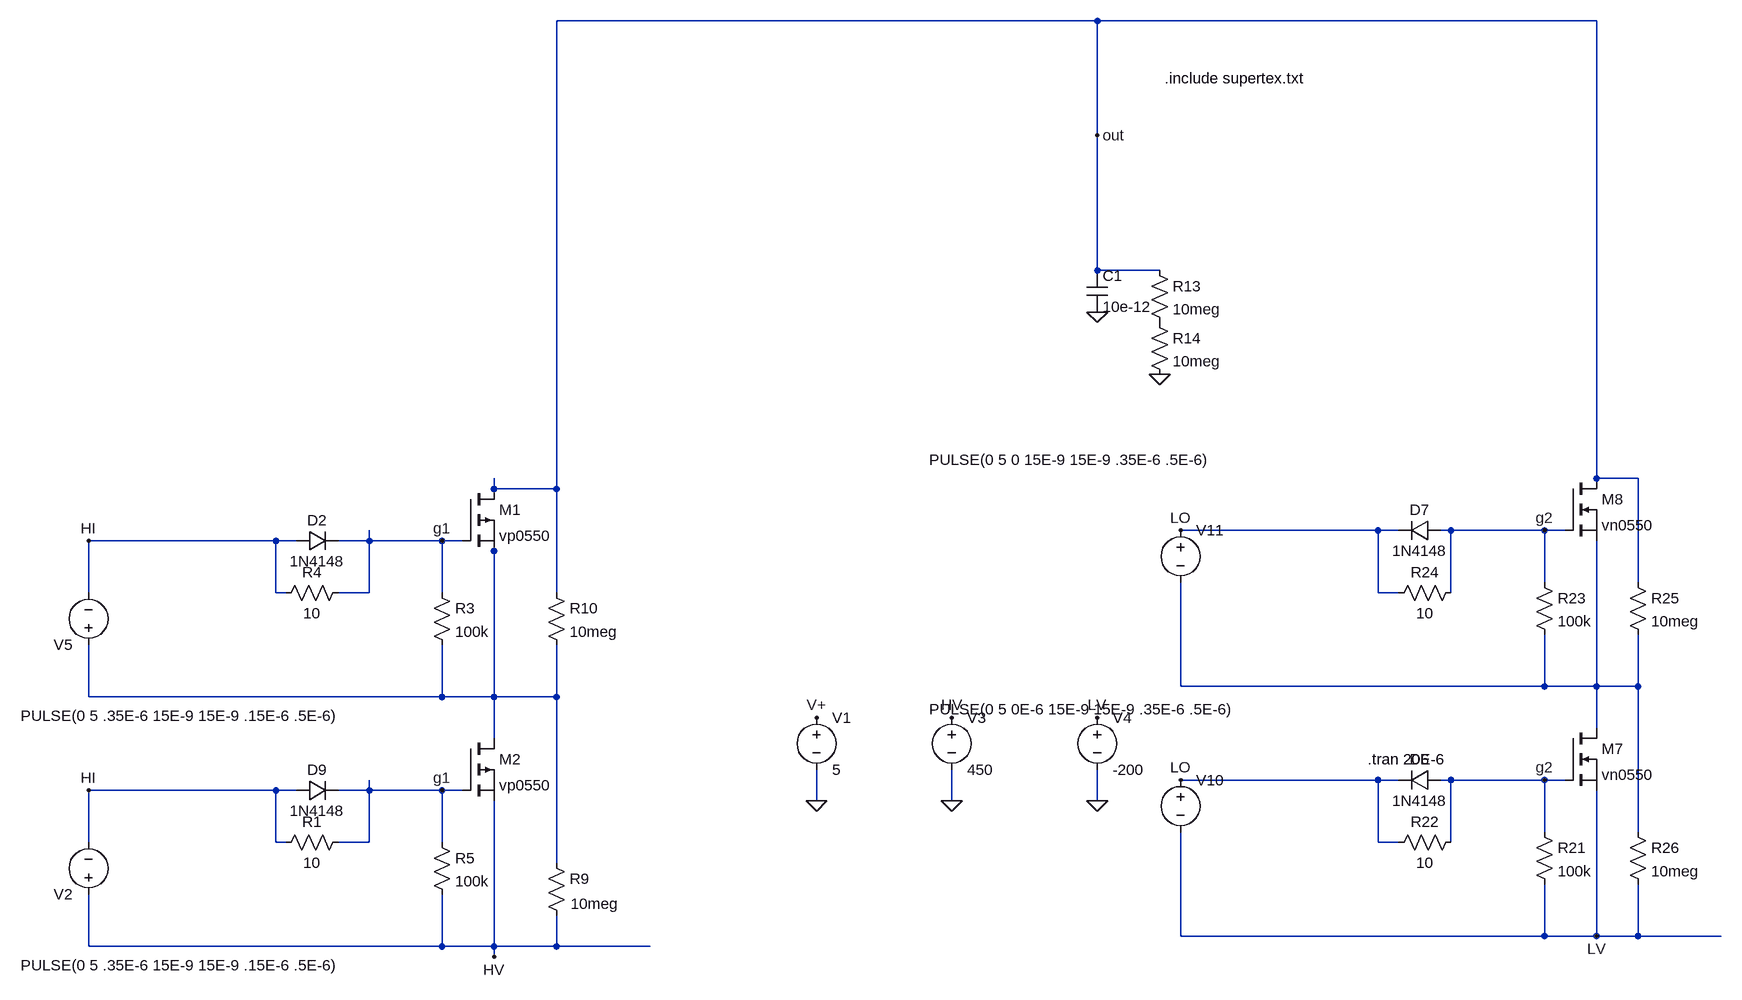
[diagram p0: schematic halfbridge_pn.asc]
halfbridge_pn.asc, the LTspice schematic file:
Version 4
SHEET 1 2900 692
WIRE 1488 -2624 656 -2624
WIRE 2256 -2624 1488 -2624
WIRE 1488 -2448 1488 -2624
WIRE 1488 -2240 1488 -2448
WIRE 1584 -2240 1488 -2240
WIRE 2256 -1920 2256 -2624
WIRE 2320 -1920 2256 -1920
WIRE 560 -1904 560 -1920
WIRE 656 -1904 656 -2624
WIRE 656 -1904 560 -1904
WIRE 2256 -1904 2256 -1920
WIRE 1920 -1840 1616 -1840
WIRE 1952 -1840 1920 -1840
WIRE 2032 -1840 2016 -1840
WIRE 2176 -1840 2032 -1840
WIRE 2208 -1840 2176 -1840
WIRE 224 -1824 -64 -1824
WIRE 256 -1824 224 -1824
WIRE 368 -1824 368 -1840
WIRE 368 -1824 320 -1824
WIRE 480 -1824 368 -1824
WIRE 512 -1824 480 -1824
WIRE 560 -1808 560 -1856
WIRE 2176 -1760 2176 -1840
WIRE 2320 -1760 2320 -1920
WIRE -64 -1744 -64 -1824
WIRE 224 -1744 224 -1824
WIRE 240 -1744 224 -1744
WIRE 368 -1744 368 -1824
WIRE 368 -1744 320 -1744
WIRE 480 -1744 480 -1824
WIRE 656 -1744 656 -1904
WIRE 1920 -1744 1920 -1840
WIRE 1952 -1744 1920 -1744
WIRE 2032 -1744 2032 -1840
WIRE 1616 -1600 1616 -1760
WIRE 2176 -1600 2176 -1680
WIRE 2176 -1600 1616 -1600
WIRE 2256 -1600 2256 -1824
WIRE 2256 -1600 2176 -1600
WIRE 2320 -1600 2320 -1680
WIRE 2320 -1600 2256 -1600
WIRE -64 -1584 -64 -1664
WIRE 480 -1584 480 -1664
WIRE 480 -1584 -64 -1584
WIRE 560 -1584 560 -1808
WIRE 560 -1584 480 -1584
WIRE 656 -1584 656 -1664
WIRE 656 -1584 560 -1584
WIRE 2256 -1536 2256 -1600
WIRE 560 -1520 560 -1584
WIRE 1920 -1456 1616 -1456
WIRE 1952 -1456 1920 -1456
WIRE 2032 -1456 2016 -1456
WIRE 2176 -1456 2032 -1456
WIRE 2208 -1456 2176 -1456
WIRE 224 -1440 -64 -1440
WIRE 256 -1440 224 -1440
WIRE 368 -1440 368 -1456
WIRE 368 -1440 320 -1440
WIRE 480 -1440 368 -1440
WIRE 512 -1440 480 -1440
WIRE 1056 -1424 1056 -1472
WIRE 1264 -1424 1264 -1472
WIRE 1488 -1424 1488 -1472
WIRE 2176 -1376 2176 -1456
WIRE 2320 -1376 2320 -1600
WIRE -64 -1360 -64 -1440
WIRE 224 -1360 224 -1440
WIRE 240 -1360 224 -1360
WIRE 368 -1360 368 -1440
WIRE 368 -1360 320 -1360
WIRE 480 -1360 480 -1440
WIRE 1920 -1360 1920 -1456
WIRE 1952 -1360 1920 -1360
WIRE 2032 -1360 2032 -1456
WIRE 656 -1328 656 -1584
WIRE 1616 -1216 1616 -1376
WIRE 2176 -1216 2176 -1296
WIRE 2176 -1216 1616 -1216
WIRE 2256 -1216 2256 -1440
WIRE 2256 -1216 2176 -1216
WIRE 2320 -1216 2320 -1296
WIRE 2320 -1216 2256 -1216
WIRE 2448 -1216 2320 -1216
WIRE -64 -1200 -64 -1280
WIRE 480 -1200 480 -1280
WIRE 480 -1200 -64 -1200
WIRE 560 -1200 560 -1424
WIRE 560 -1200 480 -1200
WIRE 656 -1200 656 -1248
WIRE 656 -1200 560 -1200
WIRE 800 -1200 656 -1200
WIRE 560 -1184 560 -1200
FLAG 1264 -1424 0
FLAG 1264 -1552 HV
FLAG 1488 -1424 0
FLAG 1488 -1552 LV
FLAG 560 -1184 HV
FLAG 1056 -1424 0
FLAG 1056 -1552 V+
FLAG -64 -1440 HI
FLAG 480 -1440 g1
FLAG 1488 -2448 out
FLAG 1488 -2176 0
FLAG -64 -1824 HI
FLAG 480 -1824 g1
FLAG 1584 -2080 0
FLAG 1616 -1456 LO
FLAG 2176 -1456 g2
FLAG 1616 -1840 LO
FLAG 2176 -1840 g2
FLAG 2256 -1216 LV
SYMBOL voltage 1264 -1568 R0
WINDOW 123 0 0 Left 2
WINDOW 39 0 0 Left 2
SYMATTR InstName V3
SYMATTR Value 450
SYMBOL voltage 1488 -1568 R0
WINDOW 123 0 0 Left 2
WINDOW 39 0 0 Left 2
SYMATTR InstName V4
SYMATTR Value -200
SYMBOL diode 256 -1424 R270
WINDOW 0 32 32 VTop 2
WINDOW 3 0 32 VBottom 2
SYMATTR InstName D9
SYMATTR Value 1N4148
SYMBOL voltage 1056 -1568 R0
WINDOW 123 0 0 Left 2
WINDOW 39 0 0 Left 2
SYMATTR InstName V1
SYMATTR Value 5
SYMBOL voltage -64 -1264 R180
WINDOW 3 -387 -93 Left 2
WINDOW 123 0 0 Left 2
WINDOW 39 0 0 Left 2
SYMATTR Value PULSE(0 5 .35E-6 15E-9 15E-9 .15E-6 .5E-6)
SYMATTR InstName V2
SYMBOL res 464 -1376 R0
SYMATTR InstName R5
SYMATTR Value 100k
SYMBOL res 336 -1376 R90
WINDOW 0 0 56 VBottom 2
WINDOW 3 32 56 VTop 2
SYMATTR InstName R1
SYMATTR Value 10
SYMBOL cap 1472 -2240 R0
SYMATTR InstName C1
SYMATTR Value 10e-12
SYMBOL pmos 512 -1520 R0
SYMATTR InstName M2
SYMATTR Value vp0550
SYMBOL diode 256 -1808 R270
WINDOW 0 32 32 VTop 2
WINDOW 3 0 32 VBottom 2
SYMATTR InstName D2
SYMATTR Value 1N4148
SYMBOL voltage -64 -1648 R180
WINDOW 3 -387 -93 Left 2
WINDOW 123 0 0 Left 2
WINDOW 39 0 0 Left 2
SYMATTR Value PULSE(0 5 .35E-6 15E-9 15E-9 .15E-6 .5E-6)
SYMATTR InstName V5
SYMBOL res 464 -1760 R0
SYMATTR InstName R3
SYMATTR Value 100k
SYMBOL res 336 -1760 R90
WINDOW 0 0 56 VBottom 2
WINDOW 3 32 56 VTop 2
SYMATTR InstName R4
SYMATTR Value 10
SYMBOL pmos 512 -1904 R0
SYMATTR InstName M1
SYMATTR Value vp0550
SYMBOL res 640 -1344 R0
WINDOW 3 38 78 Left 2
SYMATTR Value 10meg
SYMATTR InstName R9
SYMBOL res 640 -1760 R0
SYMATTR InstName R10
SYMATTR Value 10meg
SYMBOL res 1568 -2256 R0
SYMATTR InstName R13
SYMATTR Value 10meg
SYMBOL res 1568 -2176 R0
SYMATTR InstName R14
SYMATTR Value 10meg
SYMBOL voltage 1616 -1472 R0
WINDOW 3 -387 -93 Left 2
WINDOW 123 0 0 Left 2
WINDOW 39 0 0 Left 2
SYMATTR Value PULSE(0 5 0E-6 15E-9 15E-9 .35E-6 .5E-6)
SYMATTR InstName V10
SYMBOL res 2160 -1392 R0
SYMATTR InstName R21
SYMATTR Value 100k
SYMBOL res 2048 -1376 R90
WINDOW 0 0 56 VBottom 2
WINDOW 3 32 56 VTop 2
SYMATTR InstName R22
SYMATTR Value 10
SYMBOL diode 2016 -1472 R90
WINDOW 0 0 32 VBottom 2
WINDOW 3 32 32 VTop 2
SYMATTR InstName D6
SYMATTR Value 1N4148
SYMBOL nmos 2208 -1536 R0
SYMATTR InstName M7
SYMATTR Value vn0550
SYMBOL voltage 1616 -1856 R0
WINDOW 3 -387 -93 Left 2
WINDOW 123 0 0 Left 2
WINDOW 39 0 0 Left 2
SYMATTR Value PULSE(0 5 0 15E-9 15E-9 .35E-6 .5E-6)
SYMATTR InstName V11
SYMBOL res 2160 -1776 R0
SYMATTR InstName R23
SYMATTR Value 100k
SYMBOL res 2048 -1760 R90
WINDOW 0 0 56 VBottom 2
WINDOW 3 32 56 VTop 2
SYMATTR InstName R24
SYMATTR Value 10
SYMBOL diode 2016 -1856 R90
WINDOW 0 0 32 VBottom 2
WINDOW 3 32 32 VTop 2
SYMATTR InstName D7
SYMATTR Value 1N4148
SYMBOL nmos 2208 -1920 R0
SYMATTR InstName M8
SYMATTR Value vn0550
SYMBOL res 2304 -1776 R0
SYMATTR InstName R25
SYMATTR Value 10meg
SYMBOL res 2304 -1392 R0
SYMATTR InstName R26
SYMATTR Value 10meg
TEXT 1904 -1488 Left 2 !.tran 20E-6
TEXT 1592 -2536 Left 2 !.include supertex.txt

The netlist it stands for:
* halfbridge_pn.asc
V3 HV 0 450
V4 LV 0 -200
D9 HI g1 1N4148
V1 V+ 0 5
V2 HV HI PULSE(0 5 .35E-6 15E-9 15E-9 .15E-6 .5E-6)
R5 g1 HV 100k
R1 g1 HI 10
C1 out 0 10e-12
M2 N001 g1 HV HV vp0550
D2 HI g1 1N4148
V5 N001 HI PULSE(0 5 .35E-6 15E-9 15E-9 .15E-6 .5E-6)
R3 g1 N001 100k
R4 g1 HI 10
M1 out g1 N001 N001 vp0550
R9 N001 HV 10meg
R10 out N001 10meg
R13 out P001 10meg
R14 P001 0 10meg
V10 LO LV PULSE(0 5 0E-6 15E-9 15E-9 .35E-6 .5E-6)
R21 g2 LV 100k
R22 g2 LO 10
D6 g2 LO 1N4148
M7 N002 g2 LV LV vn0550
V11 LO N002 PULSE(0 5 0 15E-9 15E-9 .35E-6 .5E-6)
R23 g2 N002 100k
R24 g2 LO 10
D7 g2 LO 1N4148
M8 out g2 N002 N002 vn0550
R25 out N002 10meg
R26 N002 LV 10meg
.model D D
.lib standard.dio
.model NMOS NMOS
.model PMOS PMOS
.lib standard.mos
.tran 20E-6
.include supertex.txt
.backanno
.end